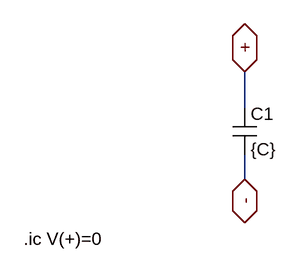
[diagram p0: schematic COM_CAP.asc]
COM_CAP.asc, the LTspice schematic file:
Version 4
SHEET 1 880 680
WIRE 448 336 448 288
WIRE 448 432 448 400
FLAG 448 288 +
IOPIN 448 288 BiDir
FLAG 448 432 -
IOPIN 448 432 BiDir
SYMBOL cap 432 336 R0
SYMATTR InstName C1
SYMATTR Value {C}
TEXT 152 512 Left 2 !.ic V(+)=0

The netlist it stands for:
* COM_CAP.asc
C1 + - {C}
.ic V(+)=0
.backanno
.end